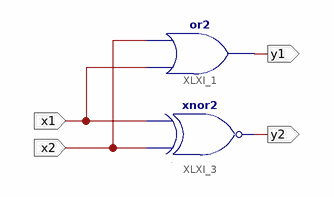
[diagram p0: schematic sheet 1]
// Xilinx ISE schematic zad1.sch (xc9500xl) as structural Verilog: 2 symbols, 4 ports
module zad1 (
  input  x1,
  input  x2,
  output y1,
  output y2
);

  or XLXI_1 (y1, x1, x2);
  xnor XLXI_3 (y2, x2, x1);
endmodule
